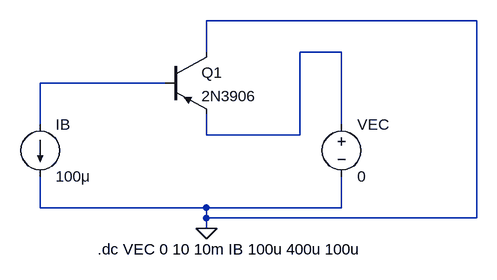
[diagram p0: schematic BJT_transistors3.asc]
BJT_transistors3.asc, the LTspice schematic file:
Version 4.1
SHEET 1 880 680
WIRE 640 -48 224 -48
WIRE 224 0 224 -48
WIRE 432 0 368 0
WIRE 160 48 -32 48
WIRE -32 112 -32 48
WIRE 432 112 432 0
WIRE 224 128 224 96
WIRE 368 128 368 0
WIRE 368 128 224 128
WIRE -32 240 -32 192
WIRE 224 240 -32 240
WIRE 432 240 432 192
WIRE 432 240 224 240
WIRE 224 256 224 240
WIRE 640 256 640 -48
WIRE 640 256 224 256
WIRE 224 272 224 256
FLAG 224 272 0
SYMBOL pnp 160 0 R0
SYMATTR InstName Q1
SYMATTR Value 2N3906
SYMBOL voltage 432 96 R0
SYMATTR InstName VEC
SYMATTR Value 0
SYMBOL current -32 112 R0
SYMATTR InstName IB
SYMATTR Value 100μ
TEXT 56 304 Left 2 !.dc VEC 0 10 10m IB 100u 400u 100u

The netlist it stands for:
* BJT_transistors3.asc
Q1 0 N002 N001 0 2N3906
VEC N001 0 0
IB N002 0 100μ
.model NPN NPN
.model PNP PNP
.lib standard.bjt
.dc VEC 0 10 10m IB 100u 400u 100u
.backanno
.end